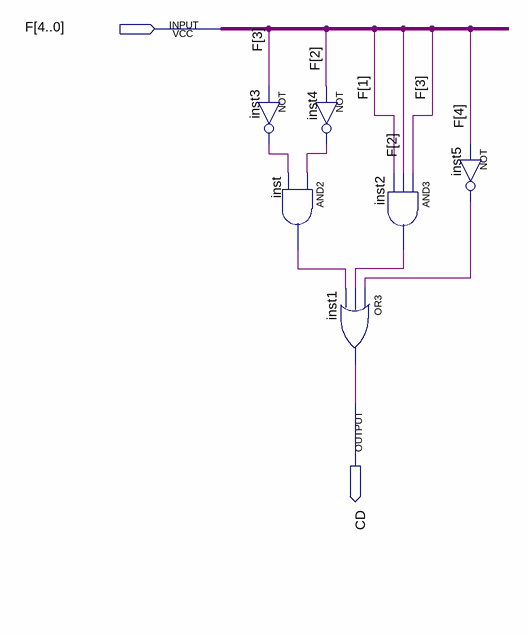
[diagram p0: schematic sheet]
// Quartus schematic CD.bdf as structural Verilog: 6 symbols, 2 pins
module CD (
  input  [4:0] F,
  output CD
);

  wire inst2_out, inst3_out, inst4_out, inst5_out, inst_out;

  not inst3 (inst3_out, F[3]);
  and inst (inst_out, inst4_out, inst3_out);
  not inst4 (inst4_out, F[2]);
  and inst2 (inst2_out, F[3], F[2], F[1]);
  or inst1 (CD, inst5_out, inst2_out, inst_out);
  not inst5 (inst5_out, F[4]);
endmodule
